# EAGLE design 1 (EAGLE 7.5.0)
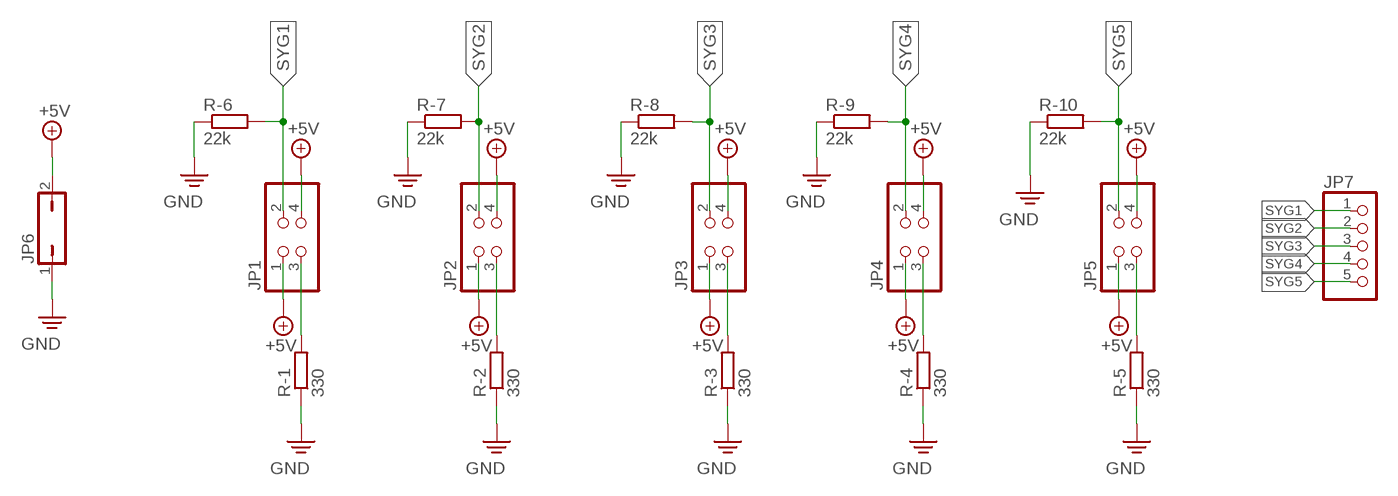
[diagram p0: schematic, sheet 1]

## Parts
JP1  PINHD-2X2  [2X02]
JP2  PINHD-2X2  [2X02]
JP3  PINHD-2X2  [2X02]
JP4  PINHD-2X2  [2X02]
JP5  PINHD-2X2  [2X02]
JP6  JP1Q  [JP1]
JP7  PINHD-1X5  [1X05]
R-1  330  R-EU_0204/7  [0204/7]
R-2  330  R-EU_0204/7  [0204/7]
R-3  330  R-EU_0204/7  [0204/7]
R-4  330  R-EU_0204/7  [0204/7]
R-5  330  R-EU_0204/7  [0204/7]
R-6  22k  R-EU_0204/7  [0204/7]
R-7  22k  R-EU_0204/7  [0204/7]
R-8  22k  R-EU_0204/7  [0204/7]
R-9  22k  R-EU_0204/7  [0204/7]
R-10  22k  R-EU_0204/7  [0204/7]

## Nets
+5V: JP1.1 JP1.4 JP2.1 JP2.4 JP3.1 JP3.4 JP4.1 JP4.4 JP5.1 JP5.4 JP6.2
N$1: JP1.3 R-1.2
N$2: JP2.3 R-2.2
N$3: JP3.3 R-3.2
N$4: JP4.3 R-4.2
N$5: JP5.3 R-5.2
PE: JP6.1 R-1.1 R-2.1 R-3.1 R-4.1 R-5.1 R-6.1 R-7.1 R-8.1 R-9.1 R-10.1 ; supply symbol labelled GND
SYG1: JP1.2 JP7.1 R-6.2
SYG2: JP2.2 JP7.2 R-7.2
SYG3: JP3.2 JP7.3 R-8.2
SYG4: JP4.2 JP7.4 R-9.2
SYG5: JP5.2 JP7.5 R-10.2

## Library data of the parts
JP1-JP5 = pinhead:PINHD-2X2: PIN HEADER
JP6 = jumper:JP1Q: JUMPER
JP7 = pinhead:PINHD-1X5: PIN HEADER
R-1-R-10 = rcl:R-EU_: RESISTOR, European symbol

## Board
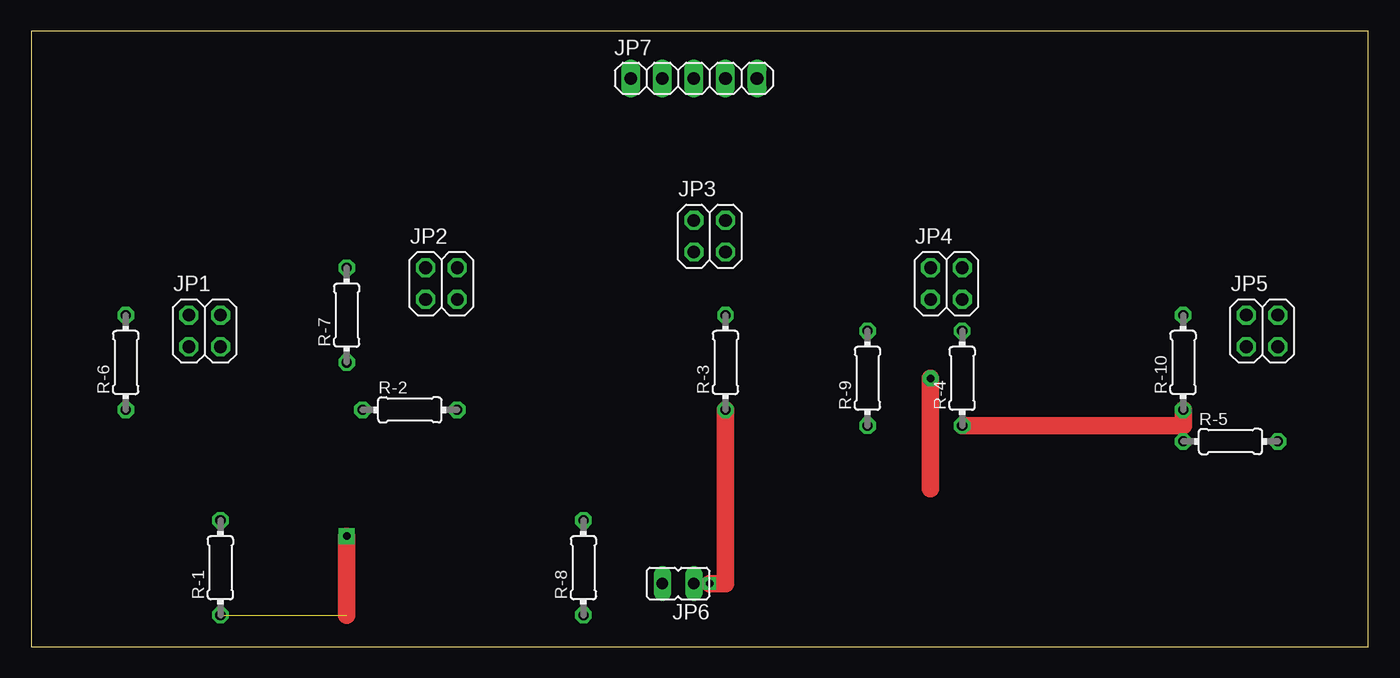
[diagram p1: board, top side]
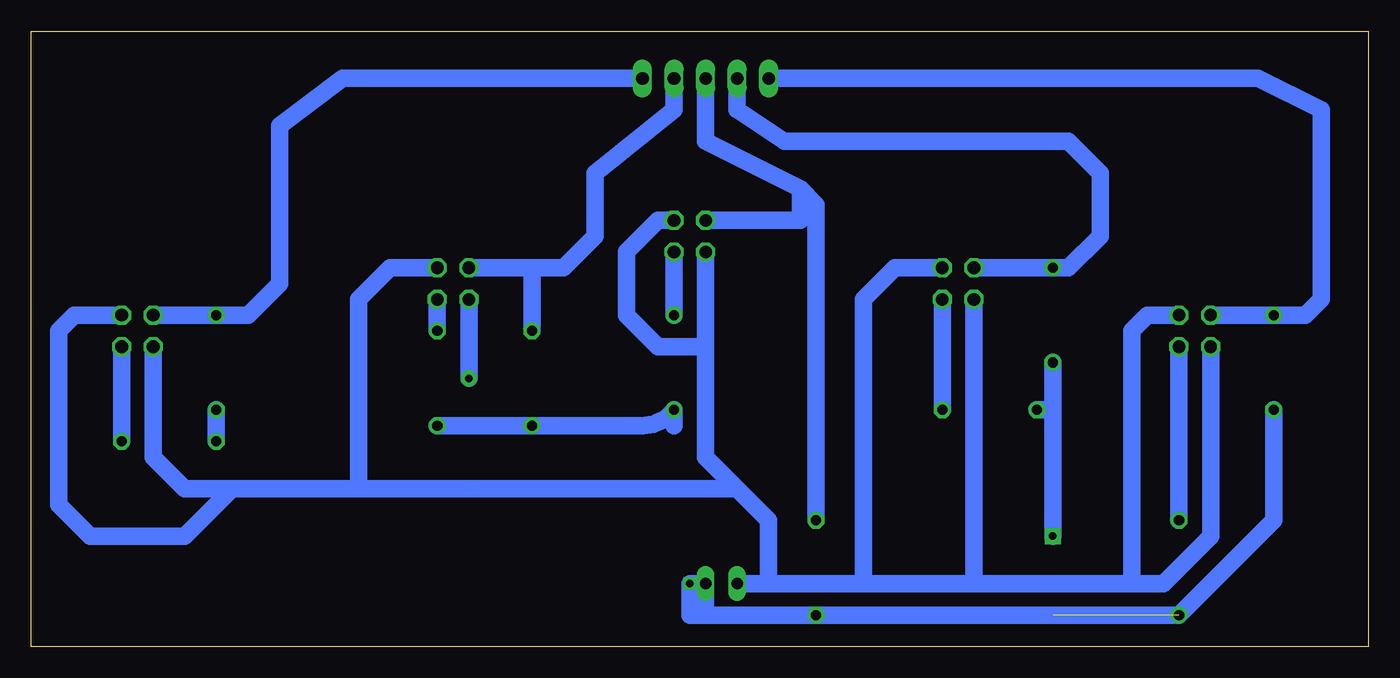
[diagram p2: board, bottom side, seen from below]

Size 107.62 x 49.52 mm. Coordinates in mm from the lower left corner, seen from the top.
Outline: 0,0 107.62,0 107.62,49.52 0,49.52 0,0
Copper layers (1*16): Top 0.035mm / dielectric 1.5mm / Bottom 0.035mm
Design rules "default": minimum track width 10mil, minimum drill 24mil, track to track 8mil, track to pad 8mil, pad to pad 8mil, via to via 8mil, smd to smd 8mil, copper to edge 40mil, drill to drill 8mil, minimum pad ring 10mil, minimum via ring 8mil, stop-mask expansion 4mil, vias tented up to drill 0mil, thermal gap 10mil

### Footprints (pad centres in the part's own frame; a part is rotated, then mirrored left to right if it is on the bottom)
2X02 = drill 1.016 octagon: 1 -1.27,-1.27; 2 -1.27,1.27; 3 1.27,-1.27; 4 1.27,1.27
JP1 = drill 0.914 long: 1 0,-1.27; 2 0,1.27
1X05 = drill 1.016 long: 1 -5.08,0; 2 -2.54,0; 3 0,0; 4 2.54,0; 5 5.08,0
0204/7 = drill 0.813 octagon: 1 -3.81,0; 2 3.81,0

### Placement (x,y rotation side)
JP1  13.97,25.4 0 top
JP2  33.02,29.21 0 top
JP3  54.61,33.02 0 top
JP4  73.66,29.21 0 top
JP5  99.06,25.4 0 top
JP6  52.07,5.08 90 top
JP7  53.34,45.72 0 top
R-1  15.24,6.35 90 top
R-2  30.48,19.05 0 top
R-3  55.88,22.86 90 top
R-4  74.93,21.59 90 top
R-5  96.52,16.51 0 top
R-6  7.62,22.86 90 top
R-7  25.4,26.67 90 top
R-8  44.45,6.35 90 top
R-9  67.31,21.59 90 top
R-10  92.71,22.86 90 top

### Tracks (layer width: path | path; a pad name or v marks a point on that pad's centre or on a via)
+5V  (via drill 0.6 pad 1.27)  (1 unrouted)
  Top 1.422: v72.39,21.59 72.39,12.7
  Bottom 1.422: JP1.1 12.7,8.89 16.51,5.08 19.05,5.08 | 19.05,5.08 31.75,5.08 | 31.75,5.08 40.64,5.08 | 40.64,5.08 48.26,5.08 | 48.26,5.08 JP6.2 | JP1.4 17.78,26.67 19.05,25.4 19.05,5.08 | JP2.4 38.1,30.48 40.64,27.94 40.64,5.08 | JP2.1 31.75,5.08 | JP3.1 53.34,24.13 | 53.34,24.13 53.34,15.24 50.8,12.7 | 50.8,12.7 48.26,10.16 48.26,5.08 | JP5.1 97.79,15.24 95.25,12.7 91.44,12.7 | 91.44,12.7 81.28,12.7 | 81.28,12.7 50.8,12.7 | JP5.4 104.14,26.67 105.41,25.4 105.41,11.43 102.87,8.89 95.25,8.89 91.44,12.7 | JP4.4 78.74,30.48 81.28,27.94 81.28,12.7 | JP3.4 57.15,34.29 59.69,31.75 59.69,26.67 57.15,24.13 53.34,24.13 | JP4.1 v72.39,21.59
N$1
  Bottom 1.422: R-1.2 JP1.3
N$2
  Bottom 1.422: R-2.2 JP2.3
N$3
  Bottom 1.422: R-3.2 JP3.3
N$4
  Bottom 1.422: R-4.2 JP4.3
N$5
  Bottom 1.422: R-5.2 JP5.3
PE  (via drill 0.6, 0.6 pad 1.27)  (1 unrouted)
  Top 1.422: R-4.1 92.71,17.78 R-10.1 | v54.61,5.08 55.88,5.08 R-3.1 | v25.4,8.89 25.4,2.54
  Bottom 1.422: JP6.1 53.34,3.81 | R-5.1 R-10.1 | R-4.1 R-9.1 58.42,17.78 arc-53 R-3.1 55.88,17.78 | R-6.1 7.62,10.16 R-1.1 R-8.1 52.07,2.54 53.34,2.54 | 53.34,2.54 JP6.1 | 25.4,19.05 R-2.1 | R-7.1 25.4,19.05 | 53.34,2.54 54.61,2.54 v54.61,5.08 JP6.1 | 25.4,19.05 v25.4,8.89
SYG1
  Bottom 1.422: JP1.2 R-6.2 5.08,26.67 3.81,27.94 3.81,43.18 8.89,45.72 JP7.1
SYG2
  Bottom 1.422: R-7.2 JP2.2 24.13,30.48 21.59,33.02 21.59,38.1 24.13,40.64 46.99,40.64 50.8,43.18 JP7.2
SYG3
  Bottom 1.422: JP3.2 45.72,34.29 45.72,36.83 | 45.72,36.83 53.34,40.64 JP7.3 | R-8.2 44.45,35.56 45.72,36.83
SYG4
  Bottom 1.422: JP7.4 55.88,43.18 62.23,38.1 62.23,33.02 64.77,30.48 67.31,30.48 | 67.31,30.48 JP4.2 | R-9.2 67.31,30.48
SYG5
  Bottom 1.422: JP5.2 R-10.2 90.17,26.67 87.63,29.21 87.63,41.91 82.55,45.72 JP7.5